# Altium schematic sheet 05_UART_Interface.SchDoc
size A4; SheetNumber: 7; SheetTotal: 9
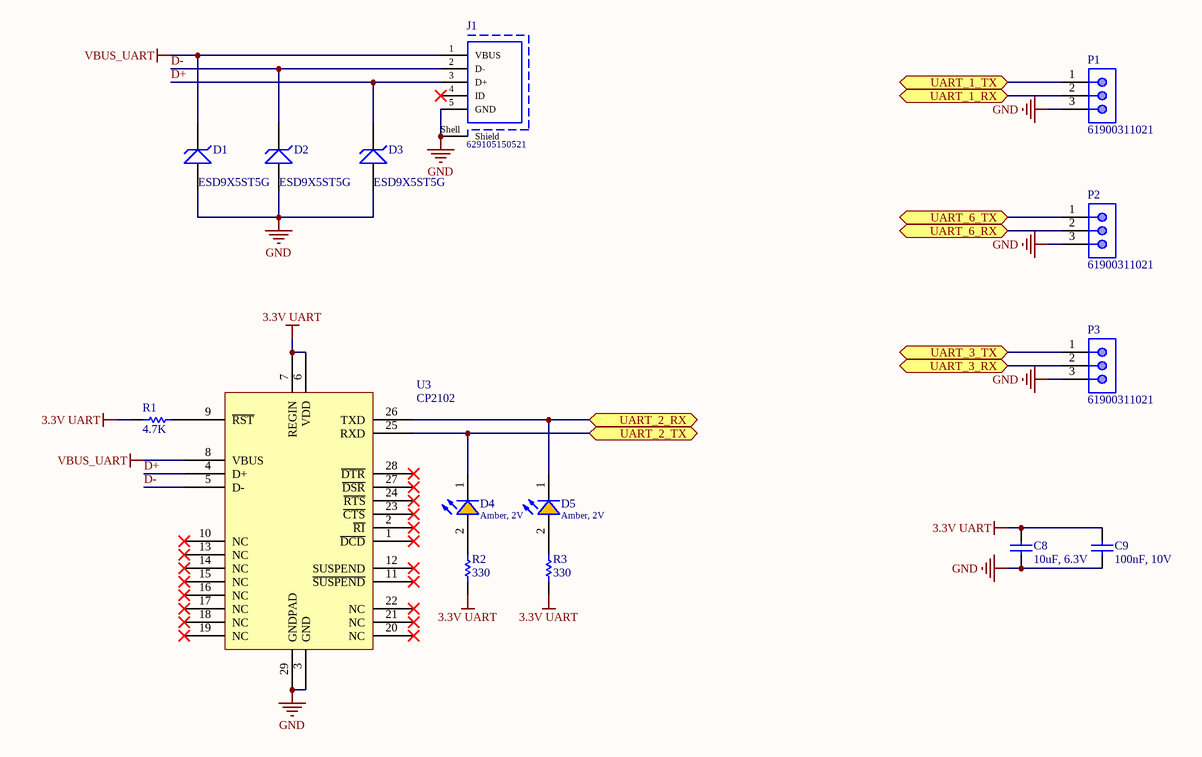
[diagram p0: 05_UART_Interface.SchDoc]

## Parts
C8  10uF, 6.3V  [WCAP-CSGP_0603_H=0.8mm_Reflow]
C9  100nF, 10V  [WCAP-CSGP_0603_H=0.8mm_Reflow]
D1  ESD9X5ST5G  [SODFL100X40-2N]
D2  ESD9X5ST5G  [SODFL100X40-2N]
D3  ESD9X5ST5G  [SODFL100X40-2N]
D4  Amber, 2V  [WL-SMCW_0603_H=0.7mm]
D5  Amber, 2V  [WL-SMCW_0603_H=0.7mm]
J1  629105150521  [629105150521]
P1  61900311021  [61900311021]
P2  61900311021  [61900311021]
P3  61900311021  [61900311021]
R1  value 4.7K  [RES-SM-0603]  (hidden comment: RESISTOR SMD)
R2  value 330  [RES-SM-0603]  (hidden comment: RESISTOR SMD)
R3  value 330  [RES-SM-0603]  (hidden comment: RESISTOR SMD)
U3  CP2102  [QFN50P500X500X90_HS-29N]

## Ports
UART_1_RX (bidir), UART_1_TX (bidir), UART_2_RX (bidir), UART_2_TX (bidir), UART_3_RX (bidir), UART_3_TX (bidir), UART_6_RX (bidir), UART_6_TX (bidir)

## Nets
3.3V UART: C8.2 C9.2 R1.2 R2.2 R3.2 U3.6(VDD) U3.7(REGIN)
GND: C8.1 C9.1 D1.2 D2.2 D3.2 J1.5(GND) J1.Shell(Shield) P1.3 P2.3 P3.3 U3.3(GND) U3.29(GNDPAD)
VBUS_UART: D1.1 J1.1(VBUS) U3.8(VBUS)
D+: D3.1 J1.3(D+) U3.4(D+)
D-: D2.1 J1.2(D-) U3.5(D-)
UART_1_RX: P1.2 ; port UART_1_RX
UART_1_TX: P1.1 ; port UART_1_TX
UART_2_RX: D5.1(K) U3.26(TXD) ; port UART_2_RX
UART_2_TX: D4.1(K) U3.25(RXD) ; port UART_2_TX
UART_3_RX: P3.2 ; port UART_3_RX
UART_3_TX: P3.1 ; port UART_3_TX
UART_6_RX: P2.2 ; port UART_6_RX
UART_6_TX: P2.1 ; port UART_6_TX
NetD4_2: D4.2(A) R2.1
NetD5_2: D5.2(A) R3.1
NetR1_1: R1.1 U3.9(~{RST})

Not connected (* = marked no-connect by the designer): J1 4(ID)*; U3 1(~{DCD})* 2(~{RI})* 10(NC)* 11(~{SUSPEND})* 12(SUSPEND)* 13(NC)* 14(NC)* 15(NC)* 16(NC)* 17(NC)* 18(NC)* 19(NC)* 20(NC)* 21(NC)* 22(NC)* 23(~{CTS})* 24(~{RTS})* 27(~{DSR})* 28(~{DTR})*

## Library data of the parts
C8 = 885012106006: WCAP-CSGP Multilayer Ceramic Chip Capacitor, General Purpose, size 0603, X5R, 10uF, 6.3V; Manufacturer: Wurth Elektronik; Rated Voltage: 6.3VDC; Isolation Resistance: >=0.01GOhm; Capacitance Tolerance: +/-20%; Technical Reference: X5R0603106M6R3DFCT10000; ComponentLink1Description: Manufacturer; ComponentLink1URL: http://www.we-online.de; ComponentLink2Description: Datasheet; ComponentLink2URL: https://www.we-online.com/catalog/datasheet/885012106006.pdf; Operating Temperature: -55 to +85degC; Packaging: Tape and Reel; Manufacturer Part Number: 885012106006; Published Date: May 2020; Ceramic Type: X5R; Dissipation Factor: =<10%; Height: 0.8mm; Mounting Technology: SMT; Size: 0603; Capacitance: 10uF
C9 = 885012206020: WCAP-CSGP Multilayer Ceramic Chip Capacitor, General Purpose, size 0603, X7R, 100nF, 10V; Manufacturer: Wurth Elektronik; Rated Voltage: 10VDC; Isolation Resistance: >=5GOhm; Capacitance Tolerance: +/-10%; Technical Reference: X7R0603104K010DFCT10000; ComponentLink1Description: Manufacturer; ComponentLink1URL: http://www.we-online.de; ComponentLink2Description: Datasheet; ComponentLink2URL: https://www.we-online.com/catalog/datasheet/885012206020.pdf; Operating Temperature: -55 to +125degC; Packaging: Tape and Reel; Manufacturer Part Number: 885012206020; Published Date: May 2020; Ceramic Type: X7R; Dissipation Factor: =<5%; Height: 0.8mm; Mounting Technology: SMT; Size: 0603; Capacitance: 100nF
D1-D3 = ESD9X5ST5G: Manufacturer: ON Semiconductor; Manufacturer P/N: ESD9X3.3ST5G; ComponentLink1Description: Supplier 1 Link; ComponentLink1URL: https://www.mouser.com/ProductDetail/ON-Semiconductor/ESD9X33ST5G/?qs=OSf9jACorvbAKluOtJV5Vg%3D%3D; Supplier 1: Mouser; Supplier 1 P/N: 863-ESD9X3.3ST5G
D4 D5 = 150060AS75000: WL-SMCW SMT Mono-color Chip LED Waterclear, size 0603, Amber, 2V, 140deg; Chip Technology: AlInGaP; Dominant Wavelength typ.: 605nm; Luminous Intensity typ.: 130mcd; Peak Wavelength typ.: 610nm; Viewing Angle: 140deg; ComponentLink1Description: Manufacturer; ComponentLink1URL: http://www.we-online.de; ComponentLink2URL: https://www.we-online.com/catalog/datasheet/150060AS75000.pdf; ComponentLink2Description: Datasheet; Forward Voltage typ.: 2V; Emitting Color: Amber; Mounting Technology: SMT; Operating Temperature: -40 to +85degC; Published Date: December 2019; Part Number: 150060AS75000; Packaging: Tape and Reel; Size: 0603; Publisher: Wurth Elektronik
J1 = 629105150521: Micro USB 2.0 Type B Receptacle WR-COM, Horizontal, SMT, with Pegs, High Current at Pin 1 & Pin 5; Rated Current: 3 A; Contact Resistance: 30 mOhm; Working Voltage: 30 VAC; ComponentLink1Description: Manufacturer; ComponentLink1URL: http://www.we-online.de; ComponentLink2Description: Datasheet; ComponentLink2URL: https://katalog.we-online.de/em/datasheet/629105150521.pdf; Part Number: 629105150521; Published Date: September 2018; Publisher: Wurth Elektronik; Orientation: Horizontal; Connector Type: Micro USB 2.0 Type B; Operating Temperature: -40 to 85 degC; Mounting Technology: SMT; Gender: Receptacle; Packaging: Tape and Reel
P1-P3 = 61900311021: WR-WTB THT Male Left Angled Bottom Locking Header, pitch 2.54mm, 3p; Pin Number: 3; Contact Resistance: 20mOhm; Rated Current: 3A; Withstanding Voltage: 1000VAC; Working Voltage: 250VAC; ComponentLink1Description: Manufacturer; ComponentLink1URL: http://www.we-online.de; ComponentLink2Description: Datasheet; ComponentLink2URL: https://www.we-online.com/catalog/datasheet/61900311021.pdf; Pitch: 2.54mm; Published Date: January 2020; Publisher: Wurth Elektronik; Mounting Technology: THT; Packaging: Bag; Operating Temperature: -40 to +105degC; Part Number: 61900311021; Gender: Male; Type: Right Angled Bottom Locking
R1-R3 = RESISTOR SMD: Resistor